# Altium schematic sheet Controller.SchDoc
size A2
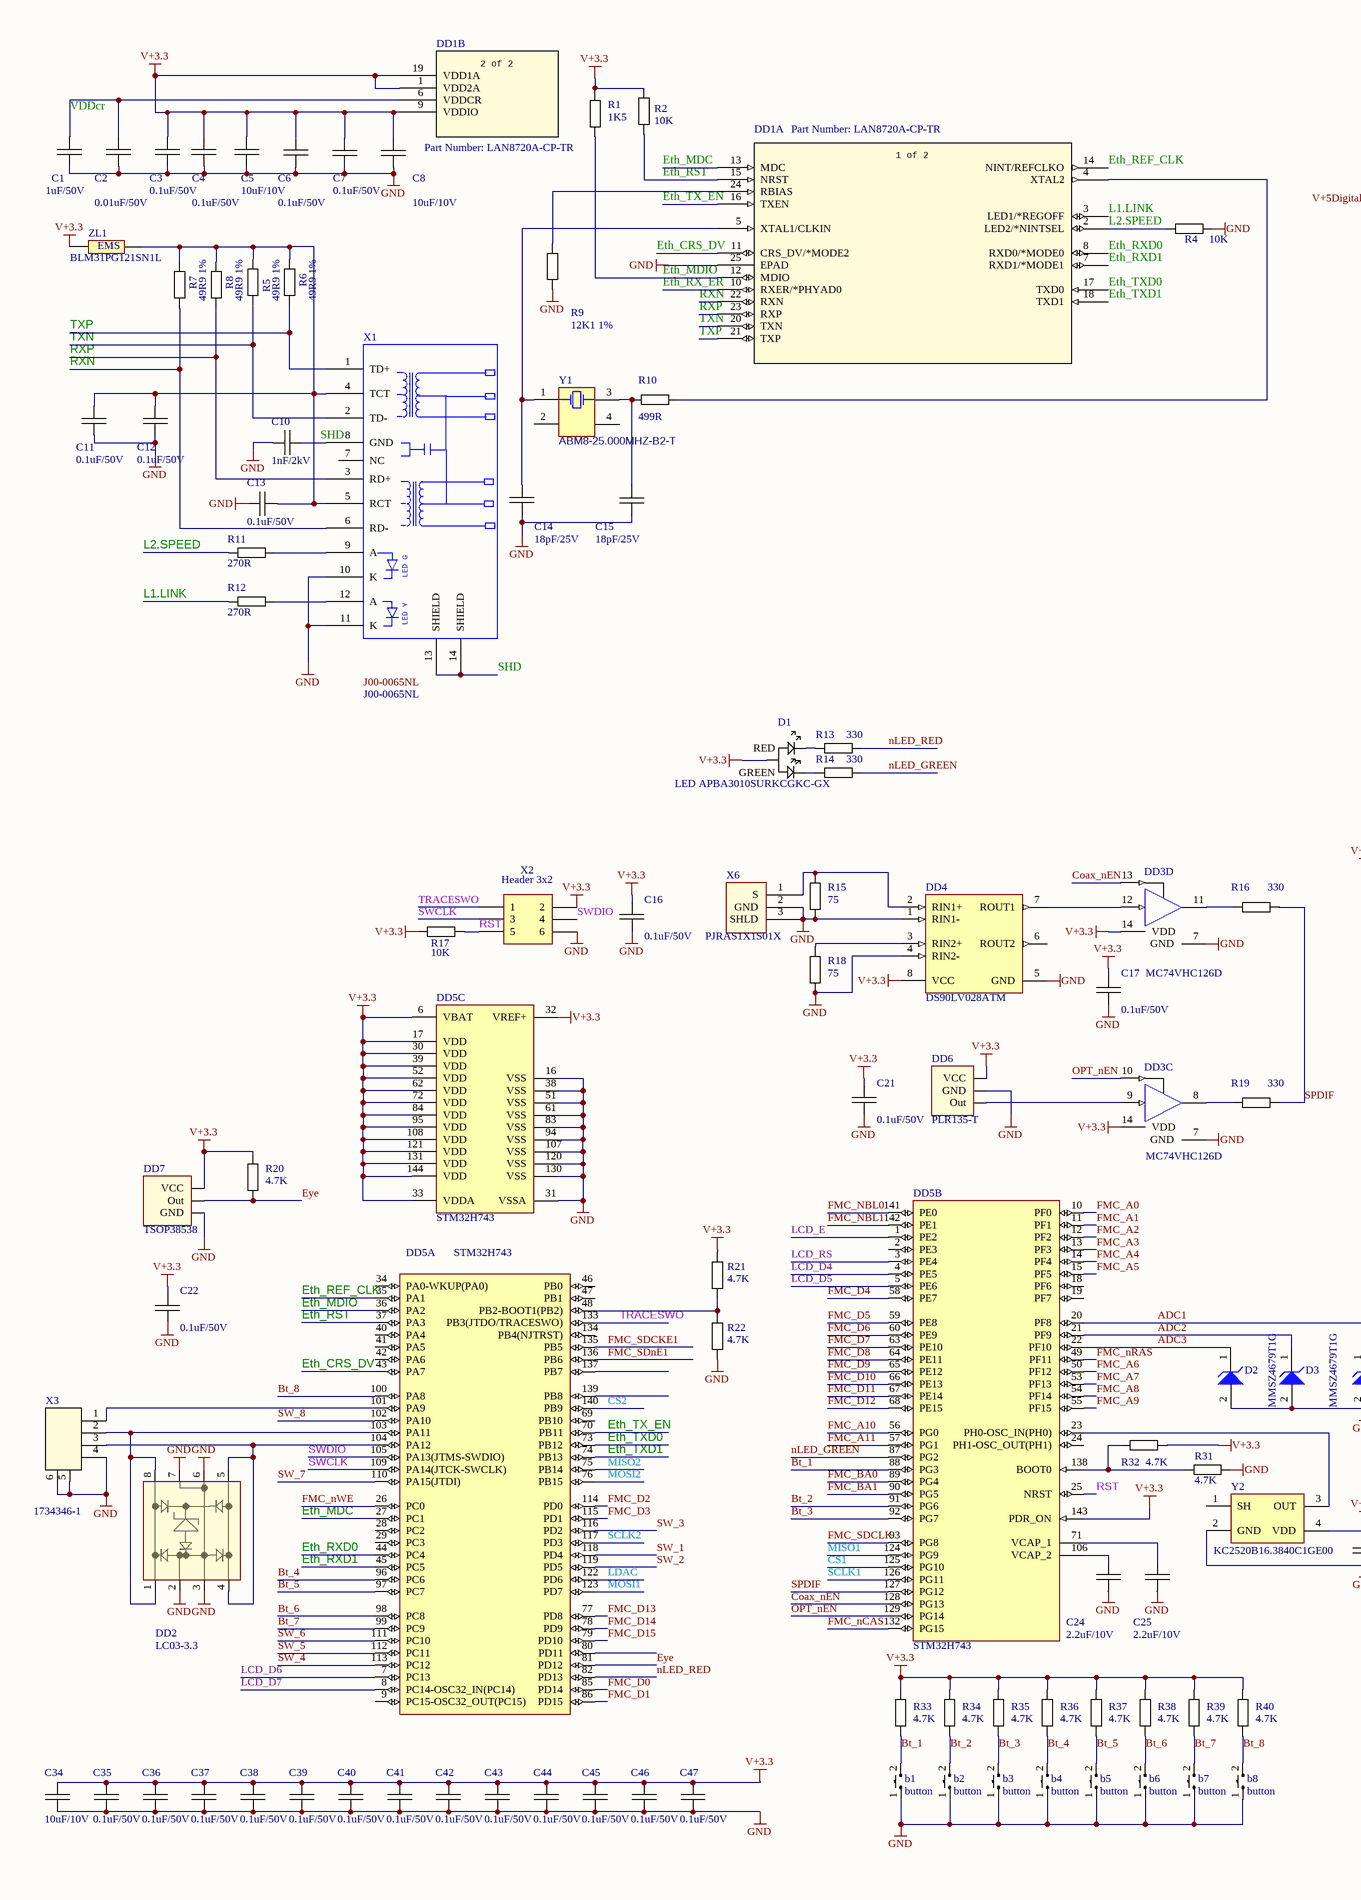
[diagram p0: Controller.SchDoc, left]
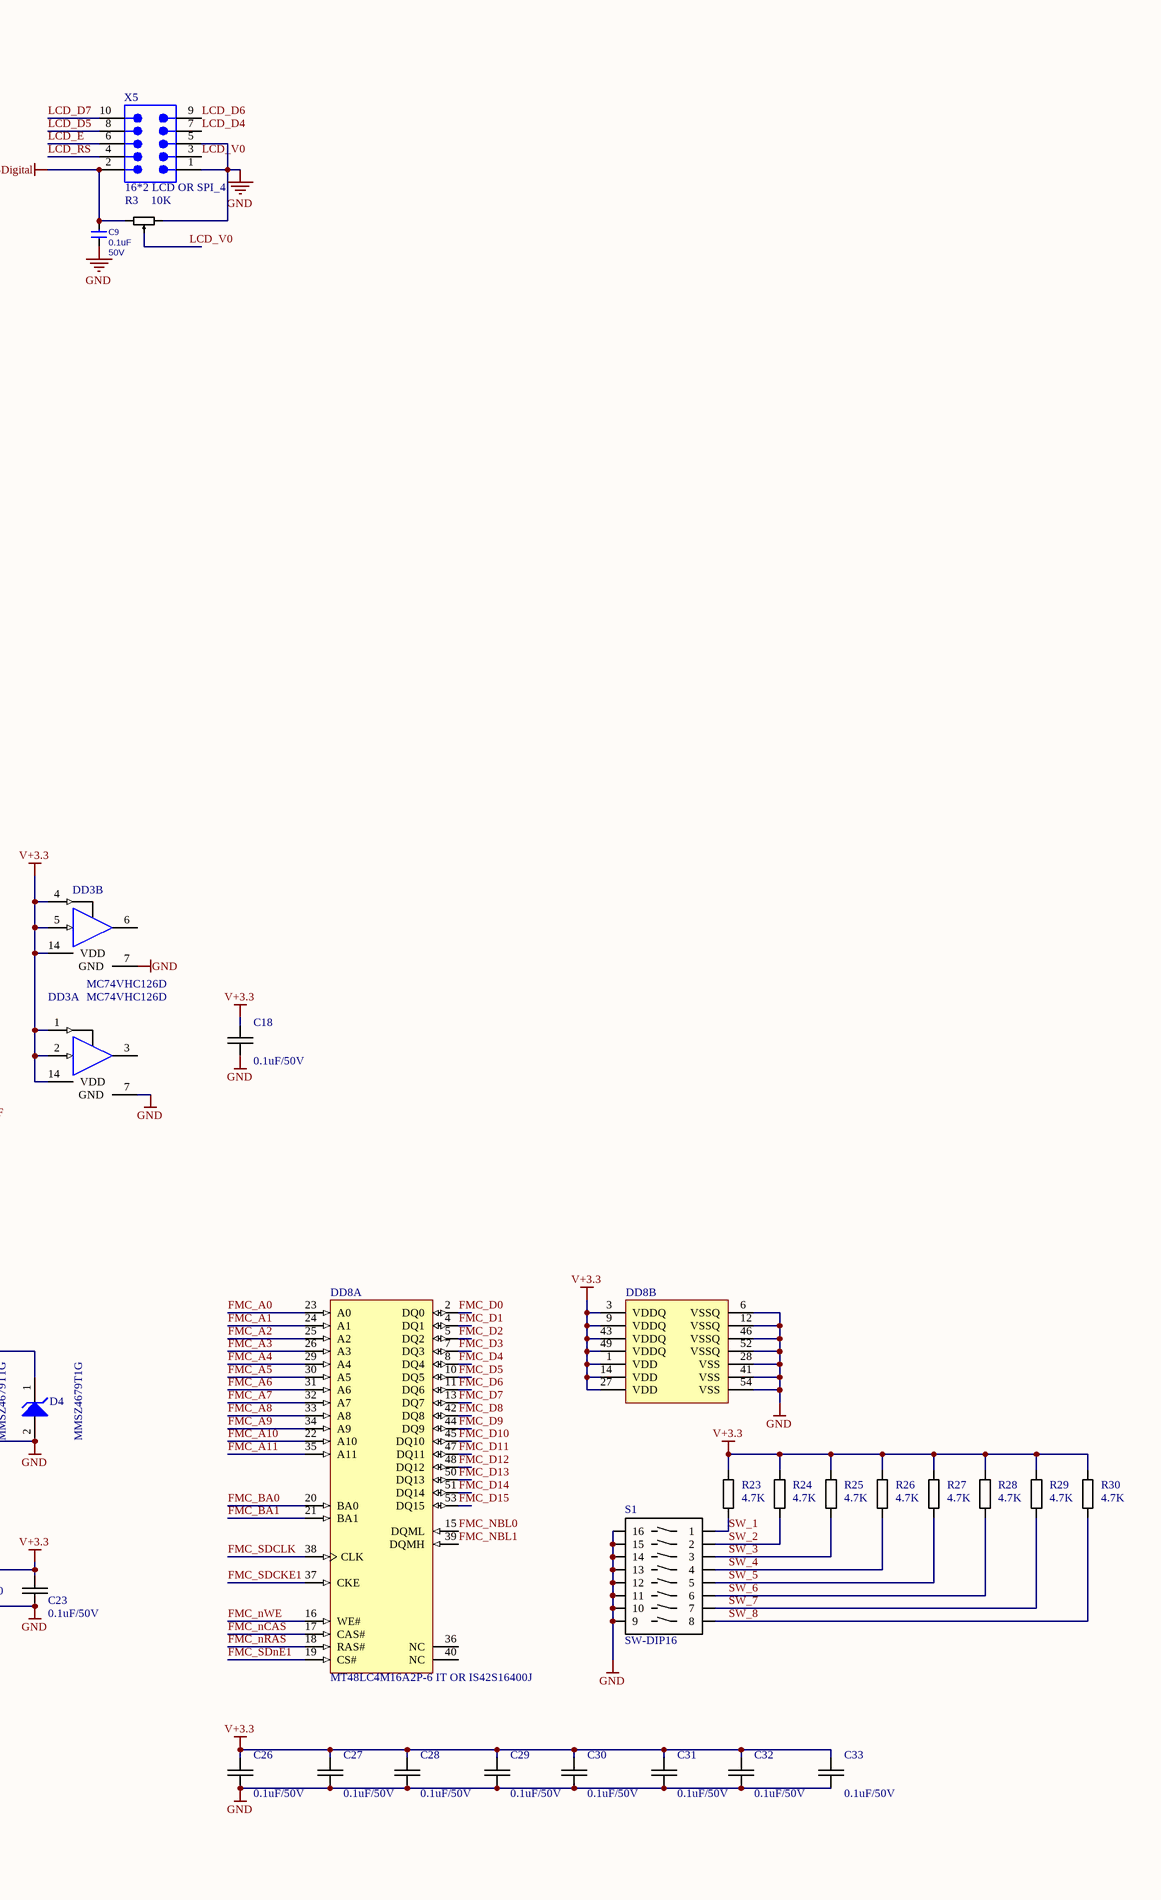
[diagram p1: Controller.SchDoc, right]

## Parts
b1  button  [button_r]
b2  button  [button_r]
b3  button  [button_r]
b4  button  [button_r]
b5  button  [button_r]
b6  button  [button_r]
b7  button  [button_r]
b8  button  [button_r]
C1  1uF/50V  [CAPACITOR 0603]
C2  0.01uF/50V  [CAPACITOR 0603]
C3  0.1uF/50V  [CAPACITOR 0603]
C4  0.1uF/50V  [CAPACITOR 0603]
C5  10uF/10V  [CAPACITOR 0603]
C6  0.1uF/50V  [CAPACITOR 0603]
C7  0.1uF/50V  [CAPACITOR 0603]
C8  10uF/10V  [CAPACITOR 0603]
C9  Capacitance: 0.1uF  Voltage: 50V  [C_1206]
C10  1nF/2kV  [CAPACITOR 1206]
C11  0.1uF/50V  [CAPACITOR 0603]
C12  0.1uF/50V  [CAPACITOR 0603]
C13  0.1uF/50V  [CAPACITOR 0603]
C14  18pF/25V  [CAPACITOR 0603]
C15  18pF/25V  [CAPACITOR 0603]
C16  0.1uF/50V  [CAPACITOR 0603]
C17  0.1uF/50V  [CAPACITOR 0603]
C18  0.1uF/50V  [CAPACITOR 0603]
C21  0.1uF/50V  [CAPACITOR 0603]
C22  0.1uF/50V  [CAPACITOR 0603]
C23  0.1uF/50V  [CAPACITOR 0603]
C24  2.2uF/10V  [CAPACITOR 0603]
C25  2.2uF/10V  [CAPACITOR 0603]
C26  0.1uF/50V  [CAPACITOR 0603]
C27  0.1uF/50V  [CAPACITOR 0603]
C28  0.1uF/50V  [CAPACITOR 0603]
C29  0.1uF/50V  [CAPACITOR 0603]
C30  0.1uF/50V  [CAPACITOR 0603]
C31  0.1uF/50V  [CAPACITOR 0603]
C32  0.1uF/50V  [CAPACITOR 0603]
C33  0.1uF/50V  [CAPACITOR 0603]
C34  10uF/10V  [CAPACITOR 0603]
C35  0.1uF/50V  [CAPACITOR 0603]
C36  0.1uF/50V  [CAPACITOR 0603]
C37  0.1uF/50V  [CAPACITOR 0603]
C38  0.1uF/50V  [CAPACITOR 0603]
C39  0.1uF/50V  [CAPACITOR 0603]
C40  0.1uF/50V  [CAPACITOR 0603]
C41  0.1uF/50V  [CAPACITOR 0603]
C42  0.1uF/50V  [CAPACITOR 0603]
C43  0.1uF/50V  [CAPACITOR 0603]
C44  0.1uF/50V  [CAPACITOR 0603]
C45  0.1uF/50V  [CAPACITOR 0603]
C46  0.1uF/50V  [CAPACITOR 0603]
C47  0.1uF/50V  [CAPACITOR 0603]
D1  LED APBA3010SURKCGKC-GX  [LED_RG_APBA3010SURKCGKC-GX]
D2  MMSZ4679T1G  [ONSC-SOD-123-2-425-04_V]
D3  MMSZ4679T1G  [ONSC-SOD-123-2-425-04_V]
D4  MMSZ4679T1G  [ONSC-SOD-123-2-425-04_V]
DD1  Part Number: LAN8720A-CP-TR  [QFN24-6X6_MC-M]  (parts A,B of 2)
DD2  LC03-3.3  [SOIC-8]
DD3  MC74VHC126D  [751A-03_M]  (parts A,B,C,D of 4)
DD4  DS90LV028ATM  [M08A_N]
DD5  STM32H743  [STM-LQFP144_N]  (parts A,B,C of 3)
DD6  PLR135-T  [PLR135-T]
DD7  TSOP38538  [TSOP38538]
DD8  MT48LC4M16A2P-6 IT OR IS42S16400J  [MICT-P-54_N]  (parts A,B of 2)
R1  1K5  [Resistor 0603]
R2  10K  [Resistor 0603]
R3  10K  [r3296]
R4  10K  [Resistor 0603]
R5  49R9 1%  [Resistor 0603]
R6  49R9 1%  [Resistor 0603]
R7  49R9 1%  [Resistor 0603]
R8  49R9 1%  [Resistor 0603]
R9  12K1 1%  [Resistor 0603]
R10  499R  [Resistor 0603]
R11  270R  [Resistor 0603]
R12  270R  [Resistor 0603]
R13  330  [Resistor 0603]
R14  330  [Resistor 0603]
R15  75  [Resistor 0603]
R16  330  [Resistor 0603]
R17  10K  [Resistor 0603]
R18  75  [Resistor 0603]
R19  330  [Resistor 0603]
R20  4.7K  [Resistor 0603]
R21  4.7K  [Resistor 0603]
R22  4.7K  [Resistor 0603]
R23  4.7K  [Resistor 0603]
R24  4.7K  [Resistor 0603]
R25  4.7K  [Resistor 0603]
R26  4.7K  [Resistor 0603]
R27  4.7K  [Resistor 0603]
R28  4.7K  [Resistor 0603]
R29  4.7K  [Resistor 0603]
R30  4.7K  [Resistor 0603]
R31  4.7K  [Resistor 0603]
R32  4.7K  [Resistor 0603]
R33  4.7K  [Resistor 0603]
R34  4.7K  [Resistor 0603]
R35  4.7K  [Resistor 0603]
R36  4.7K  [Resistor 0603]
R37  4.7K  [Resistor 0603]
R38  4.7K  [Resistor 0603]
R39  4.7K  [Resistor 0603]
R40  4.7K  [Resistor 0603]
S1  SW-DIP16  [SW-DIP16]
X1  J00-0065NL  [J00-0065NL]
X2  Header 3x2  [idc6]
X3  1734346-1  [CONN_1-1734346-1]
X5  16*2 LCD OR SPI_4  [BH-10]
X6  PJRAS1X1S01X  [RCA_connector]
Y1  ABM8-25.000MHZ-B2-T  [CFPX-5]
Y2  KC2520B16.3840C1GE00  [Clock Oscillator ASDMB]
ZL1  BLM31PG121SN1L  [BLM31]

## Nets
GND: b1.1 b2.1 b3.1 b4.1 b5.1 b6.1 b7.1 b8.1 C1.1 C2.1 C3.1 C4.1 C5.1 C6.2 C7.1 C8.1 C9.1 C10.1 C11.1 C12.1 C13.2 C14.2 C15.1 C16.2 C17.2 C18.2 C21.2 C22.2 C23.2 C24.2 C25.2 C26.2 C27.2 C28.2 C29.2 C30.2 C31.2 C32.2 C33.2 C34.2 C35.2 C36.2 C37.2 C38.2 C39.2 C40.2 C41.2 C42.2 C43.2 C44.2 C45.2 C46.2 C47.2 D2.2(A) D3.2(A) D4.2(A) DD1.25(EPAD) DD2.2 DD2.3 DD2.6 DD2.7 DD3.7(GND) DD4.1(RIN1-) DD4.4(RIN2-) DD4.5(GND) DD5.16(VSS) DD5.31(VSSA) DD5.38(VSS) DD5.51(VSS) DD5.61(VSS) DD5.83(VSS) DD5.94(VSS) DD5.107(VSS) DD5.120(VSS) DD5.130(VSS) DD6.2(GND) DD7.2(GND) DD8.6(VSSQ) DD8.12(VSSQ) DD8.28(VSS) DD8.41(VSS) DD8.46(VSSQ) DD8.52(VSSQ) DD8.54(VSS) R3.1 R4.2 R9.1 R15.1 R18.1 R22.1 R31.2 S1.9 S1.10 S1.11 S1.12 S1.13 S1.14 S1.15 S1.16 X1.10(K) X1.11(K) X2.6 X3.4 X3.5 X3.6 X5.1 X5.5 X6.2(GND) X6.3(SHLD) Y2.2(GND)
V+3.3: C3.2 C4.2 C5.2 C6.1 C7.2 C8.2 C16.1 C17.1 C18.1 C21.1 C22.1 C23.1 C26.1 C27.1 C28.1 C29.1 C30.1 C31.1 C32.1 C33.1 C34.1 C35.1 C36.1 C37.1 C38.1 C39.1 C40.1 C41.1 C42.1 C43.1 C44.1 C45.1 C46.1 C47.1 D1.1 DD1.1(VDD2A) DD1.9(VDDIO) DD1.19(VDD1A) DD3.1(OE) DD3.2(A) DD3.4(OE) DD3.5(A) DD3.14(VDD) DD4.8(VCC) DD5.6(VBAT) DD5.17(VDD) DD5.30(VDD) DD5.32(VREF+) DD5.33(VDDA) DD5.39(VDD) DD5.52(VDD) DD5.62(VDD) DD5.72(VDD) DD5.84(VDD) DD5.95(VDD) DD5.108(VDD) DD5.121(VDD) DD5.131(VDD) DD5.143(PDR_ON) DD5.144(VDD) DD6.1(VCC) DD7.3(VCC) DD8.1(VDD) DD8.3(VDDQ) DD8.9(VDDQ) DD8.14(VDD) DD8.27(VDD) DD8.43(VDDQ) DD8.49(VDDQ) R1.2 R2.2 R17.2 R20.2 R21.2 R23.2 R24.2 R25.2 R26.2 R27.2 R28.2 R29.2 R30.2 R32.2 R33.2 R34.2 R35.2 R36.2 R37.2 R38.2 R39.2 R40.2 X2.2 Y2.4(VDD) ZL1.1  [also labelled VDD]
V+5Digital: C9.2 R3.3 X5.2
ADC1: D4.1(K) DD5.20(PF8)
ADC2: D3.1(K) DD5.21(PF9)
ADC3: D2.1(K) DD5.22(PF10)
Bt_1: b1.2 DD5.88(PG3) R33.1
Bt_2: b2.2 DD5.91(PG6) R34.1
Bt_3: b3.2 DD5.92(PG7) R35.1
Bt_4: b4.2 DD5.96(PC6) R36.1
Bt_5: b5.2 DD5.97(PC7) R37.1
Bt_6: b6.2 DD5.98(PC8) R38.1
Bt_7: b7.2 DD5.99(PC9) R39.1
Bt_8: b8.2 DD5.100(PA8) R40.1
Coax_nEN: DD3.13(OE) DD5.128(PG13)
CS1: DD5.125(PG10)
CS2: DD5.140(PB9)
Eth_CRS_DV: DD1.11(CRS_DV/*MODE2) DD5.43(PA7)
Eth_MDC: DD1.13(MDC) DD5.27(PC1)
Eth_MDIO: DD1.12(MDIO) DD5.36(PA2) R1.1
Eth_REF_CLK: DD1.14(NINT/REFCLKO) DD5.35(PA1)
Eth_RST: DD1.15(NRST) DD5.37(PA3) R2.1
Eth_RX_ER: DD1.10(RXER/*PHYAD0)
Eth_RXD0: DD1.8(RXD0/*MODE0) DD5.44(PC4)
Eth_RXD1: DD1.7(RXD1/*MODE1) DD5.45(PC5)
Eth_TX_EN: DD1.16(TXEN) DD5.70(PB11)
Eth_TXD0: DD1.17(TXD0) DD5.73(PB12)
Eth_TXD1: DD1.18(TXD1) DD5.74(PB13)
Eye: DD5.81(PD12) DD7.1(Out) R20.1
FMC_A0: DD5.10(PF0) DD8.23(A0)
FMC_A1: DD5.11(PF1) DD8.24(A1)
FMC_A2: DD5.12(PF2) DD8.25(A2)
FMC_A3: DD5.13(PF3) DD8.26(A3)
FMC_A4: DD5.14(PF4) DD8.29(A4)
FMC_A5: DD5.15(PF5) DD8.30(A5)
FMC_A6: DD5.50(PF12) DD8.31(A6)
FMC_A7: DD5.53(PF13) DD8.32(A7)
FMC_A8: DD5.54(PF14) DD8.33(A8)
FMC_A9: DD5.55(PF15) DD8.34(A9)
FMC_A10: DD5.56(PG0) DD8.22(A10)
FMC_A11: DD5.57(PG1) DD8.35(A11)
FMC_BA0: DD5.89(PG4) DD8.20(BA0)
FMC_BA1: DD5.90(PG5) DD8.21(BA1)
FMC_D0: DD5.85(PD14) DD8.2(DQ0)
FMC_D1: DD5.86(PD15) DD8.4(DQ1)
FMC_D2: DD5.114(PD0) DD8.5(DQ2)
FMC_D3: DD5.115(PD1) DD8.7(DQ3)
FMC_D4: DD5.58(PE7) DD8.8(DQ4)
FMC_D5: DD5.59(PE8) DD8.10(DQ5)
FMC_D6: DD5.60(PE9) DD8.11(DQ6)
FMC_D7: DD5.63(PE10) DD8.13(DQ7)
FMC_D8: DD5.64(PE11) DD8.42(DQ8)
FMC_D9: DD5.65(PE12) DD8.44(DQ9)
FMC_D10: DD5.66(PE13) DD8.45(DQ10)
FMC_D11: DD5.67(PE14) DD8.47(DQ11)
FMC_D12: DD5.68(PE15) DD8.48(DQ12)
FMC_D13: DD5.77(PD8) DD8.50(DQ13)
FMC_D14: DD5.78(PD9) DD8.51(DQ14)
FMC_D15: DD5.79(PD10) DD8.53(DQ15)
FMC_NBL0: DD5.141(PE0) DD8.15(DQML)
FMC_NBL1: DD5.142(PE1) DD8.39(DQMH)
FMC_nCAS: DD5.132(PG15) DD8.17(CAS#)
FMC_nRAS: DD5.49(PF11) DD8.18(RAS#)
FMC_nWE: DD5.26(PC0) DD8.16(WE#)
FMC_SDCKE1: DD5.135(PB5) DD8.37(CKE)
FMC_SDCLK: DD5.93(PG8) DD8.38(CLK)
FMC_SDnE1: DD5.136(PB6) DD8.19(CS#)
L1.LINK: DD1.3(LED1/*REGOFF) R12.1
L2.SPEED: DD1.2(LED2/*NINTSEL) R4.1 R11.1
LCD_D4: DD5.4(PE5) X5.7
LCD_D5: DD5.5(PE6) X5.8
LCD_D6: DD5.7(PC13) X5.9
LCD_D7: DD5.8(PC14-OSC32_IN(PC14)) X5.10
LCD_E: DD5.1(PE2) X5.6
LCD_RS: DD5.3(PE4) X5.4
LCD_V0: R3.2 X5.3
LDAC: DD5.122(PD6)
MISO1: DD5.124(PG9)
MISO2: DD5.75(PB14)
MOSI1: DD5.123(PD7)
MOSI2: DD5.76(PB15)
nLED_GREEN: DD5.87(PG2) R14.2
nLED_RED: DD5.82(PD13) R13.2
OPT_nEN: DD3.10(OE) DD5.129(PG14)
RST: DD5.25(NRST) R17.1 X2.5
RXN: DD1.22(RXN) R7.1 X1.6(RD-)
RXP: DD1.23(RXP) R8.1 X1.3(RD+)
SCLK1: DD5.126(PG11)
SCLK2: DD5.117(PD3)
SHD: C10.2 X1.8(GND) X1.13(SHIELD) X1.14(SHIELD)
SPDIF: DD5.127(PG12) R16.1 R19.1
SW_1: DD5.118(PD4) R23.1 S1.1
SW_2: DD5.119(PD5) R24.1 S1.2
SW_3: DD5.116(PD2) R25.1 S1.3
SW_4: DD5.113(PC12) R26.1 S1.4
SW_5: DD5.112(PC11) R27.1 S1.5
SW_6: DD5.111(PC10) R28.1 S1.6
SW_7: DD5.110(PA15(JTDI)) R29.1 S1.7
SW_8: DD5.102(PA10) R30.1 S1.8
SWCLK: DD5.109(PA14(JTCK-SWCLK)) X2.3
SWDIO: DD5.105(PA13(JTMS-SWDIO)) X2.4
TRACESWO: DD5.133(PB3(JTDO/TRACESWO)) X2.1
TXN: DD1.20(TXN) R5.1 X1.2(TD-)
TXP: DD1.21(TXP) R6.1 X1.1(TD+)
VDDcr: C1.2 C2.2 DD1.6(VDDCR)
NetC11_2: C11.2 C12.2 C13.1 R5.2 R6.2 R7.2 R8.2 X1.4(TCT) X1.5(RCT) ZL1.2
NetC14_1: C14.1 DD1.5(XTAL1/CLKIN) Y1.1(OSC1)
NetC15_2: C15.2 R10.1 Y1.3(OSC2)
NetC24_1: C24.1 DD5.106(VCAP_2)
NetC25_1: C25.1 DD5.71(VCAP_1)
NetD1_2: D1.2(RED) R13.1
NetD1_3: D1.3(GREEN) R14.1
NetDD1_4: DD1.4(XTAL2) R10.2
NetDD1_24: DD1.24(RBIAS) R9.2
NetDD2_1: DD2.1 DD2.8 DD5.103(PA11) X3.2
NetDD2_4: DD2.4 DD2.5 DD5.104(PA12) X3.3
NetDD3_8: DD3.8(Y) R19.2
NetDD3_9: DD3.9(A) DD6.3(Out)
NetDD3_11: DD3.11(Y) R16.2
NetDD3_12: DD3.12(A) DD4.7(ROUT1)
NetDD4_2: DD4.2(RIN1+) R15.2 X6.1(S)
NetDD4_3: DD4.3(RIN2+) R18.2
NetDD5_23: DD5.23(PH0-OSC_IN(PH0)) Y2.3(OUT)
NetDD5_48: DD5.48(PB2-BOOT1(PB2)) R21.1 R22.2
NetDD5_101: DD5.101(PA9) X3.1
NetDD5_138: DD5.138(BOOT0) R31.1 R32.1
NetR11_2: R11.2 X1.9(A)
NetR12_2: R12.2 X1.12(A)

Not connected (* = marked no-connect by the designer): DD3 3(Y) 6(Y); DD4 6(ROUT2); DD5 2(PE3) 9(PC15-OSC32_OUT(PC15)) 18(PF6) 19(PF7) 24(PH1-OSC_OUT(PH1)) 28(PC2) 29(PC3) 34(PA0-WKUP(PA0)) 40(PA4) 41(PA5) 42(PA6) 46(PB0) 47(PB1) 69(PB10) 80(PD11) 134(PB4(NJTRST)) 137(PB7) 139(PB8); DD8 36(NC) 40(NC); X1 7(NC); Y1 2(NC) 4(NC); Y2 1(SH)

## Notes on the sheet
- (in symbol BLM31) EMS
- (in symbol JJ RJLD260TC1 ETH) LED G; LED Y
- (in symbol LAN8720A-CP-TR, part A) 1 of 2
- (in symbol LAN8720A-CP-TR, part B) 2 of 2

## Library data of the parts
b1-b8 = Pushbutton: Manufacturer_part_number: Wurth 431256083726
C1 = Capasitor: Manufacturer_part_number: CGB3B1X7R1A105K055AC; Value: 1uF/50V
C2 = Capasitor: Manufacturer_part_number: CC0603KRX7R9BB103; Value: 0.01uF/50V
C3 C4 C6 C7 C11-C13 C16-C18 C21-C23 C26-C33 C35-C47 = Capasitor: Manufacturer_part_number: CC0603KRX7R9BB104; Value: 0.1uF/50V
C5 C8 C34 = Capasitor: Manufacturer_part_number: GRM188R61A106ME69D; Value: 10uF/10V
C9 = C_SMD_ceramic: Capacitor
C10 = Capasitor: Manufacturer_part_number: C1206C102KGRACTU; Value: 1nF/2kV
C14 C15 = Capasitor: Manufacturer_part_number: C0603C180D5GACTU; Value: 18pF/25V
C24 C25 = Capasitor: Manufacturer_part_number: C1608X7R1A225M080AC; Value: 2.2uF/10V
D1 = RG_LED: Manufacturer_part_number: APBA3010SURKCGKC-GX
D2-D4 = MMSZ4679T1G: Zener Voltage Regulator, 500 mW, 2-Pin SOD-123, Pb-Free, Tape and Reel; Manufacturer: On Semiconductor; P Max (W): 0.5; VZ Typ (V): 2; DatasheetVersion: Rev. 9; PackageVersion: Rev. G, 10/2009; PackageReference: SOD-123-2-425-04; PackageDescription: 2-Pin SOD, Body 1.6 x 2.69 mm; Supplier 1: Digi-Key; Supplier Part Number 1: MMSZ4679T1GOSTR-ND; Supplier 2: Digi-Key; Supplier Part Number 2: MMSZ4679T1GOSCT-ND; Supplier 3: Digi-Key; Supplier Part Number 3: MMSZ4679T1GOSDKR-ND; Supplier 4: Farnell; Supplier Part Number 4: 1651590; Supplier 5: Farnell; Supplier Part Number 5: 1651590RL; Supplier 6: Newark; Supplier Part Number 6: 71J6025; Supplier 7: Mouser; Supplier Part Number 7: 863-MMSZ4679T1G; Packing: Tape and Reel; RoHS: Pb-Free; Mounting Technology: Surface Mount; PartNumber: MMSZ4679T1G; ComponentLink1Description: Manufacturer URL; ComponentLink1URL: http://www.onsemi.com/; ComponentLink2Description: Datasheet; ComponentLink2URL: http://www.onsemi.com/pub_link/Collateral/MMSZ4678T1-D.PDF; ComponentLink3Description: Package Specification; ComponentLink3URL: http://www.onsemi.com/pub_link/Collateral/425-04.PDF; Manufacturer_part_number: MMSZ4679T1G
DD1 = LAN8720A-CP-TR: No Description Available; Built_By: EMA_UL_Team; Vendor: Microchip; Manufacturer_part_number: LAN8720A-CP-TR; Copyright: Copyright (C) 2018 Accelerated Designs. All rights reserved; RefDes: RefDes; Type: DEV; Value: Value
DD2 = LC03-3.3: TVS DIODE 3.3V 18V 8SO; Manufacturer_part_number: LC03-3.3.TBT
DD3 = MC74VHC126D: Quad Bus Buffer with 3-State Control Inputs; Published: 15-Apr-2002; LatestRevisionDate: 13-Apr-2006; LatestRevisionNote: IPC-7351 Footprint Added.; DatasheetVersion: 1997; PackageReference: 751A-03; Publisher: Altium Limited; PackageDescription: 14-Pin Small Outline Integrated Circuit 1.27 mm Pitch; Code_JEDEC: MS-012-AB; Code_IPC: SOIC127P600-14; ComponentLink1Description: Manufacturer Link; ComponentLink1URL: http://www.onsemi.com/; ComponentLink2Description: Datasheet; ComponentLink2URL: http://www.onsemi.com/pub/Collateral/MC74VHC126-D.PDF
DD4 = DS90LV028ATM: 3V LVDS Dual CMOS Differential Line Receiver, 8-pin Narrow SOIC; Manufacturer: National Semiconductor; PackageTopMarking: NSZXTT*90LV0*28ATM; PowerWise: N; CompType: Interface IC; High-Reliability: Y; DatasheetVersion: Aug-2005; PackageVersion: revM, May-2009; PackageReference: M08A; PackageDescription: SOIC Narrow, 4.9 x 3.9 x 1.45mm, 8 Lead, 1.27mm Pitch; PartNumber: DS90LV028ATM; RoHS: N; PinCount: 8; Code_JEDEC: MS-012-AA; Code_IPC: SOIC127P600-8; ComponentLink1Description: Manufacturer URL; ComponentLink1URL: http://www.national.com/; ComponentLink2Description: DS90LV028A Datasheet; ComponentLink2URL: http://www.national.com/ds/DS/DS90LV028A.pdf; ComponentLink3Description: DS90LV028A Web Page; ComponentLink3URL: http://www.national.com/pf/DS/DS90LV028A.html; ComponentLink4Description: M08A Package Page; ComponentLink4URL: http://www.national.com/packaging/folders/m08a.html
DD5 = STM32F429ZGT6: ARM Cortex-M4 32-bit MCU+FPU, 225 DMIPS, 1024 kB Flash, 256 kB Internal RAM, 114 I/Os, 144-pin LQFP, -40 to 85 degC, Tray; Manufacturer: STMicroelectronics; Manufacturer_part_number: STM32F429ZIT6; D/A Converter: 2x12-bit; FLASH Size (Prog) (kB): 1024; I/Os (High Current): 114; Internal RAM Size (kB): 256; Operating Frequency(F) (Processor speed) (MHz): 180; Supply Voltage(Vcc) max (V): 3.6; Supply Voltage(Vcc) min (V): 1.8; DatasheetVersion: Rev. 2; PackageVersion: Rev. 4, 06/2013; PackageReference: LQFP144; PackageDescription: 144-Pin Low Profile Quad Flat Package, 20 x 20 mm Body, 0.5 mm Pitch; Supplier 1: Digi-Key; Supplier Part Number 1: STM32F429ZGT6-ND; Supplier 2: Newark; Supplier Part Number 2: 06X3675; Supplier 3: Mouser; Supplier Part Number 3: 511-STM32F429ZGT6; Core: ARM Cortex-M4; Packing: Tray; Mounting Technology: Surface Mount; PartNumber: STM32F429ZGT6; ComponentLink1Description: Manufacturer URL; ComponentLink1URL: http://www.st.com/web/en/home.html; ComponentLink2Description: Datasheet; ComponentLink2URL: http://www.st.com/st-web-ui/static/active/en/resource/technical/document/data_brief/DM00053488.pdf; ComponentLink3Description: Package Specification; ComponentLink3URL: http://www.st.com/st-web-ui/static/active/en/resource/technical/document/datasheet/DM00037051.pdf
DD6 = PLR135-T2: Manufacturer_part_number: PLR135/T
DD8 = MT48LC4M16A2P-6 IT: 64Mb PC133 SDR SDRAM, 4Mb x 16, 6ns, 3.3V, -40C to 85 degC, 54-Pin TSOP, Pb-Free; Manufacturer: Micron; CL: CL = 3; Clock Rate: 166 MHz; Op. Temp.: -40C to +85C; DatasheetVersion: Rev.Q; PackageVersion: Rev.Q; PackageReference: MICT-P-54; PackageDescription: 54-Pin Thin Small Outline Package, 10.16 x 22.22 mm, Pitch 0.8 mm; Cycle Time: 6ns; Data Rate: PC133; Density: 64Mb; Depth: 4Mb; RoHS: Yes; Voltage: 3.3V; Width: x16; Mounting Technology: Surface Mount; PartNumber: MT48LC4M16A2P-6 IT; ComponentLink1Description: Manufacturer URL; ComponentLink1URL: http://www.micron.com/; ComponentLink2Description: Datasheet; ComponentLink2URL: http://www.micron.com/~/media/Documents/Products/Data%20Sheet/DRAM/128Mbx16x32Mobile.pdf; ComponentLink3Description: Package Specification; ComponentLink3URL: http://www.micron.com/~/media/Documents/Products/Data%20Sheet/DRAM/128mb_x4x8x16_sdram.pdf; Manufacturer_part_number: IS42S16400J
R1 = Resistor: Manufacturer_part_number: RC0603FR-071K5L; Value: 1K5
R2 R4 R17 = Resistor: Manufacturer_part_number: ERJ-3EKF1002V; Value: 10K
R3 = res3296: Value: 10K
R5-R8 = Resistor: Manufacturer_part_number: ERJ-3EKF49R9V; Value: 49R9 1%
R9 = Resistor: Manufacturer_part_number: ERJ-3EKF1212V; Value: 12K1 1%
R10 = Resistor: Manufacturer_part_number: ERJ-3EKF4990V; Value: 499R
R11 R12 = Resistor: Manufacturer_part_number: ERJ-3EKF2700V; Value: 270R
R13 R14 R16 R19 = Resistor: Manufacturer_part_number: RC0603FR-07330RL; Value: 330
R15 R18 = Resistor: Manufacturer_part_number: ERJ-3EKF75R0V; Value: 75
R20-R40 = Resistor: Manufacturer_part_number: ERJ-3EKF4701V; Value: 4.7K
S1 = SW-DIP16: 8 POLE DIP SWITCH; Manufacturer_part_number: 206-8
X1 = JJ RJLD260TC1 ETH: CONN MAGJACK 1PORT 100 BASE-TX; Right: 100; Bottom: 240; Manufacturer_part_number: J00-0065NL
X2 = Header 3x2: conn header 6pos vert 75869-131LF; LatestRevisionDate: 17-Jul-2002; LatestRevisionNote: Re-released for DXP Platform.; Publisher: Altium Limited; Manufacturer_part_number: 75869-131LF
X3 = 1734346-1: USB B connector SMT; Manufacturer_Name: Tyco Electronics Amp; Vendor: Tyco Electronics; Section: General Purpose; C: Copyright (C) 2015 Accelerated Designs. All rights reserved; Manufacturer_Part_Number: 1734346-1; Supersection: Connectors; Family: Terminals; Copyright: Copyright (C) 2015 Accelerated Designs. All rights reserved; RS_Part_Number: 7187227; Value: Value; Type: Type; RefDes: RefDes
X5 = BH-10: Flat Cable Connector (IDC), Low-Profile Male Header, Straight Solder Pin, 10 Contacts, Performance Level 3; PCB_Layout: Complies with manufacturer's recommendation.; DrillSize: Corresponds to nominal value.; Published: 15-Nov-2004; DatasheetDocument: Sep-2003; PackageDocument: 03-Jun-2003; PackageReference: 918510x324; Publisher: Altium Limited; ComponentLink1Description: Manufacturer Link; ComponentLink1URL: http://www.harting.com/; ComponentLink2Description: Selection Guide; ComponentLink2URL: http://www.harting.com/imperia/md/content/steckverbinderundsystemkomponenten/folder/interface_engl_chapter_09.pdf
X6 = RCA_connector: Manufacturer_part_number: PJRAS1X1S01X
Y1 = CFPX-5: Surface Mount Quartz Crystal; Note: PCB layout complies with manufacturer's recommendation.; Published: 17-Jul-2002; DatasheetDocument: 9-Sep-1999; PackageDocument: 9-Sep-1999; PackageReference: CFPX-5; Publisher: Altium Limited; ComponentLink1Description: Manufacturer Link; ComponentLink1URL: http://www.cmac.com/mt/; Value: ABM8-25.000MHZ-B2-T; Manufacturer_part_number: ABM8-25.000MHZ-B2-T
Y2 = Oscillator 2.5x2.0: Value: KC2520B16.3840C1GE00; Manufacturer_part_number: KC2520B16.3840C1GE00
ZL1 = BLM31: FILTER; PN: BLM31PG121SN1L
DD7 = TSOP38538: Manufacturer_part_number: TSOP38538